# Altium schematic sheet 7_ALARM.SchDoc: Alarm and sound
size B; Author: Sebastien Gelinas; CompanyName: SmartHalo; Organization: SmartHalo; Address1: 5445 de Gaspé; Address2: Montréal, QC; Address3: Canada; Address4: H2T 3B2; Revision: 1; SheetNumber: 7; SheetTotal: 8
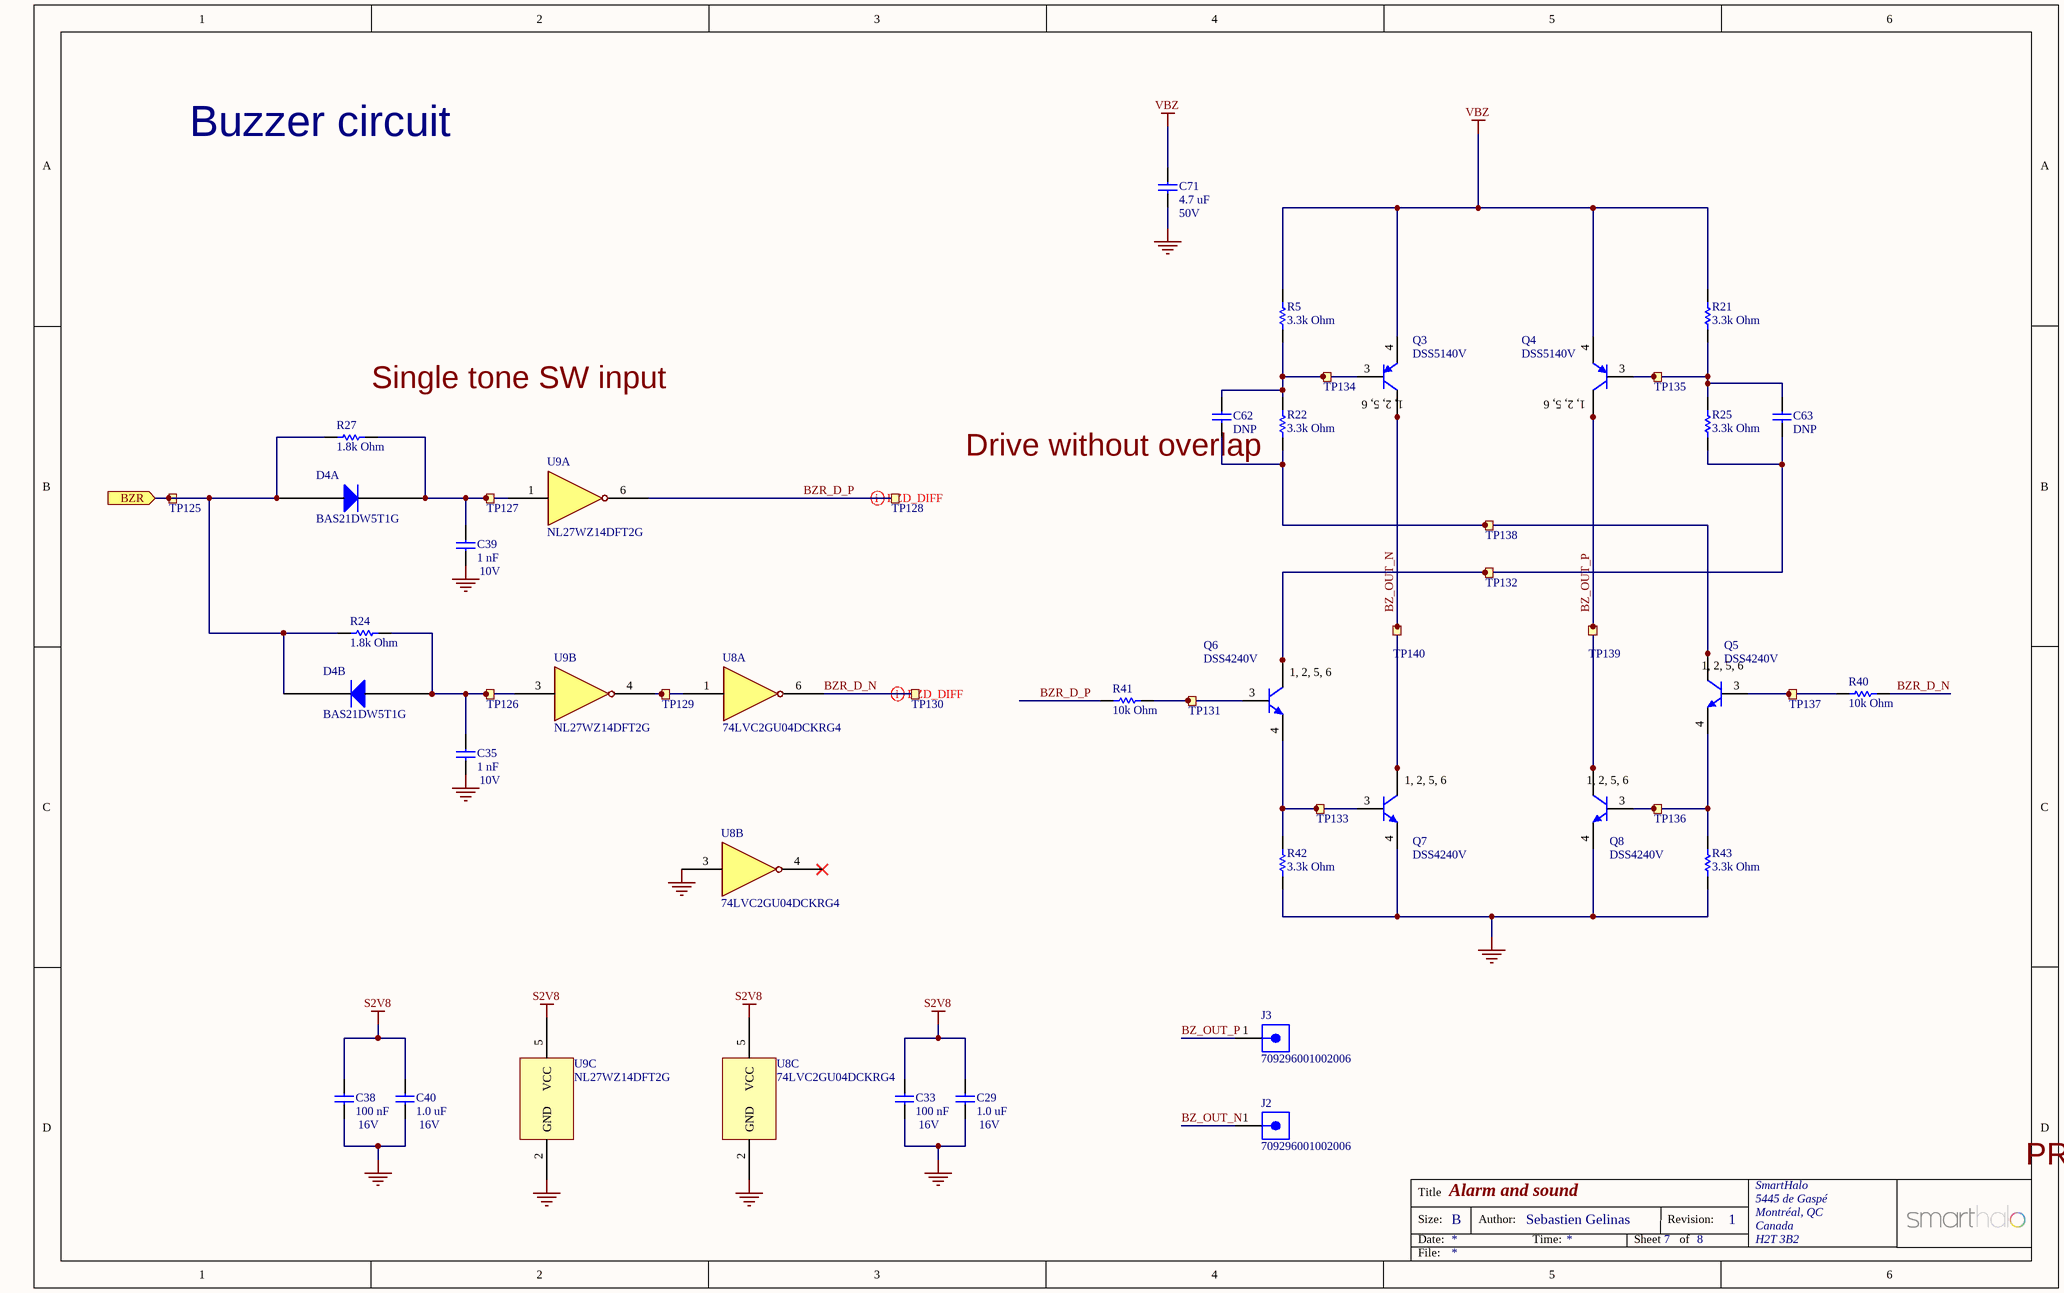
[diagram p0: 7_ALARM.SchDoc]

## Parts
C29  1.0 uF  Voltage Rating: 16V  [Varitron_CAP0603]
C33  100 nF  Voltage Rating: 16V  [Varitron_CAP0402]
C35  1 nF  Voltage Rating: 10V  [Varitron_CAP0402]
C38  100 nF  Voltage Rating: 16V  [Varitron_CAP0402]
C39  1 nF  Voltage Rating: 10V  [Varitron_CAP0402]
C40  1.0 uF  Voltage Rating: 16V  [Varitron_CAP0603]
C62  DNP  [Varitron_CAP0402]  (no BOM)
C63  DNP  [Varitron_CAP0402]  (no BOM)
C71  4.7 uF  Voltage Rating: 50V  [Varitron_CAP0805]
D4  BAS21DW5T1G  [SC70-5]  (parts A,B of 2)
J2  709296001002006  [709296001002006]
J3  709296001002006  [709296001002006]
Q3  DSS5140V  [SOT563]
Q4  DSS5140V  [SOT563]
Q5  DSS4240V  [SOT563]
Q6  DSS4240V  [SOT563]
Q7  DSS4240V  [SOT563]
Q8  DSS4240V  [SOT563]
R5  3.3k Ohm  [Varitron_RES0402]
R21  3.3k Ohm  [Varitron_RES0402]
R22  3.3k Ohm  [Varitron_RES0402]
R24  1.8k Ohm  [Varitron_RES0402]
R25  3.3k Ohm  [Varitron_RES0402]
R27  1.8k Ohm  [Varitron_RES0402]
R40  10k Ohm  [Varitron_RES0402]
R41  10k Ohm  [Varitron_RES0402]
R42  3.3k Ohm  [Varitron_RES0402]
R43  3.3k Ohm  [Varitron_RES0402]
TP125  TP125  [TESTPAD-TH-1_5mm]  (value not drawn)  (no BOM)
TP126  TP126  [TESTPAD-TH-35mils]  (value not drawn)  (no BOM)
TP127  TP127  [TESTPAD-TH-35mils]  (value not drawn)  (no BOM)
TP128  TP128  [TESTPAD-TH-35mils]  (value not drawn)  (no BOM)
TP129  TP129  [TESTPAD-TH-35mils]  (value not drawn)  (no BOM)
TP130  TP130  [TESTPAD-TH-35mils]  (value not drawn)  (no BOM)
TP131  TP131  [TESTPAD-TH-35mils]  (value not drawn)  (no BOM)
TP132  TP132  [TESTPAD-TH-35mils]  (value not drawn)  (no BOM)
TP133  TP133  [TESTPAD-TH-35mils]  (value not drawn)  (no BOM)
TP134  TP134  [TESTPAD-TH-35mils]  (value not drawn)  (no BOM)
TP135  TP135  [TESTPAD-TH-35mils]  (value not drawn)  (no BOM)
TP136  TP136  [TESTPAD-TH-35mils]  (value not drawn)  (no BOM)
TP137  TP137  [TESTPAD-TH-35mils]  (value not drawn)  (no BOM)
TP138  TP138  [TESTPAD-TH-35mils]  (value not drawn)  (no BOM)
TP139  TP139  [TESTPAD-TH-1_5mm]  (value not drawn)  (no BOM)
TP140  TP140  [TESTPAD-TH-1_5mm]  (value not drawn)  (no BOM)
U8  74LVC2GU04DCKRG4  [SOT363_SC70_6]  (parts A,B,C of 3)
U9  NL27WZ14DFT2G  [SOT363_SC70_6]  (parts A,B,C of 3)

## Ports
BZR (in)

## Nets
GND: C29.2 C33.2 C35.2 C38.2 C39.2 C40.2 C71.2 Q7.4(E) Q8.4(E) R42.2 R43.1 U8.2(GND) U8.3 U9.2(GND)
S2V8: C29.1 C33.1 C38.1 C40.1 U8.5(VCC) U9.5(VCC)
VBZ: C71.1 Q3.4(E) Q4.4(E) R5.2 R21.2
BZ_OUT_N: J2.1 Q3.1(C) Q3.2(C) Q3.5(C) Q3.6(C) Q7.1(C) Q7.2(C) Q7.5(C) Q7.6(C) TP140.1
BZ_OUT_P: J3.1 Q4.1(C) Q4.2(C) Q4.5(C) Q4.6(C) Q8.1(C) Q8.2(C) Q8.5(C) Q8.6(C) TP139.1
BZR: D4.1(Anode) D4.4(Cathode) R24.2 R27.2 TP125.1 ; port BZR
BZR_D_N: R40.2 TP130.1 U8.6
BZR_D_P: R41.2 TP128.1 U9.6
NetC35_1: C35.1 D4.3(Anode) R24.1 TP126.1 U9.3
NetC39_1: C39.1 D4.5(Cathode) R27.1 TP127.1 U9.1
NetC62_1: C62.1 Q5.1(C) Q5.2(C) Q5.5(C) Q5.6(C) R22.1 TP138.1
NetC62_2: C62.2 Q3.3(B) R5.1 R22.2 TP134.1
NetC63_1: C63.1 Q6.1(C) Q6.2(C) Q6.5(C) Q6.6(C) R25.1 TP132.1
NetC63_2: C63.2 Q4.3(B) R21.1 R25.2 TP135.1
NetQ5_3: Q5.3(B) R40.1 TP137.1
NetQ5_4: Q5.4(E) Q8.3(B) R43.2 TP136.1
NetQ6_3: Q6.3(B) R41.1 TP131.1
NetQ6_4: Q6.4(E) Q7.3(B) R42.1 TP133.1
NetTP129_1: TP129.1 U8.1 U9.4

Not connected (* = marked no-connect by the designer): D4 2; U8 4*

## Layout directives
differential pair: BZR_D_N, BZR_D_P

## Notes on the sheet
- Buzzer circuit
- (near R27) Single tone SW input
- Drive without overlap
- PRELIMINARY: DO NOT USE FOR PRODUCTION
- Title
- Size:
- Date:
- B
- Author:
- Time:
- Sheet
- Revision:
- of
- File:
- (in symbol DSS4240V) 1, 2, 5, 6
- (in symbol DSS5140V) 1, 2, 5, 6

## Library data of the parts
C29 C40 = Varitron_CAP0603: 1.0 uF 16V X7R 10% 0603 (1608 Metric)  SMD; Manufacturer: Samsung; Manufacturer Part Number: CL10B105KO8NNNC; SmartHalo Part Number: 630002-01; Case-EIA: 0603; Case-Metric: 1608; Final: N; Tolerance: 10%; Technology: SMT; Temperature Coefficient: X7R; Part Number: CL10B105KO8NNNC; Value: 1.0 uF; Supplier: Arrow Electronics; Footprint Name: 0603
C33 C38 = Varitron_CAP0402: 100 nF 16V X7R 10% 0402 (1005 Metric)  SMD; Manufacturer: Samsung; Manufacturer Part Number: CL05B104KO5NNNC; SmartHalo Part Number: 630003-01; Case-EIA: 0402; Case-Metric: 1005; Final: N; Tolerance: 10%; Technology: SMT; Temperature Coefficient: X7R; Part Number: CL05B104KO5NNNC; Value: 100 nF; Supplier: Arrow Electronics; Footprint Name: 0402
C35 C39 = Varitron_CAP0402: 1 nF 10V X7R 10% 0402 (1005 Metric)  SMD; Manufacturer: AVX; Manufacturer Part Number: 0402ZC102KAT2A; SmartHalo Part Number: 630012-01; Case-EIA: 0402; Case-Metric: 1005; Final: N; Tolerance: 10%; Technology: SMT; Temperature Coefficient: X7R; Part Number: 0402ZC102KAT2A; Value: 1 nF; Supplier: Arrow Electronics; Footprint Name: 0402
C62 C63 = Varitron_CAP0402: 220 pF 50V X7R 10% 0402 (1005 Metric)  SMD; Case-EIA: 0402; Case-Metric: 1005; Final: N; Value: 220 pF; Tolerance: 10%; Technology: SMT; Temperature Coefficient: X7R; Supplier: Arrow Electronics; Footprint Name: 0402; Voltage Rating: 50V
C71 = Varitron_CAP0805: 4.7 uF 50V X5R 10% 0805 (2012 Metric)  SMD; Manufacturer: Samsung; Manufacturer Part Number: CL21A475KBQNNNE; SmartHalo Part Number: 630010-01; Case-EIA: 0805; Case-Metric: 2012; Final: N; Tolerance: 10%; Technology: SMT; Temperature Coefficient: X5R; Part Number: CL21A475KBQNNNE; Supplier: Arrow Electronics; Footprint Name: 0805; Value: 4.7 uF
D4 = BAS21DW5T1G: High Voltage Switching Diode; Manufacturer: ON Semiconductor; SmartHalo Part Number: 630018-01; Final: Y; Manufacturer Part Number: BAS21DW5T1G; Part Number: BAS21DW5T1G; Footprint Name: SC70-5; Supplier: Arrow Electronics
J2 J3 = 709296001002006: Connector, Single Horizontal Contact, 2 x 2 mm; Manufacturer: AVX; SmartHalo Part Number: 630020-01; Final: Y; Manufacturer Part Number: 709296001002006; Part Number: 709296001002006; Footprint Name: CUSTOM(Wire to board connector); Supplier: Arrow Electronics; Supplier Part Number: *
Q3 Q4 = DSS5140V: PNP SMT Transistor, Low VCESAT; Manufacturer: Diodes Inc.; SmartHalo Part Number: 630031-01; Final: N; hfe: 300; VBE: -1V; VCESAT: -310 mV; Supplier: Arrow Electronics; Part Number: DSS5140V; Manufacturer Part Number: DSS5140V; Footprint Name: SOT563
Q5-Q8 = DSS4240V: NPN SMT Transistor, Low VCESAT; Manufacturer: Diodes Inc.; SmartHalo Part Number: 630032-01; Final: N; hfe: 300; VBE: 1.1V; VCESAT: 400 mV; Supplier: Arrow Electronics; Part Number: DSS4240V; Manufacturer Part Number: DSS4240V; Footprint Name: SOT563
R5 = Varitron_RES0402: 3k3 0.063W 5%  0402 (1005 Metric)  SMD; Manufacturer: Samsung; Manufacturer Part Number: RC1005J332CS; SmartHalo Part Number: 630037-01; Case-Metric: 1005; Power: 0.063; Case-EIA: 0402; Final: N; Tolerance: 5%; Technology: SMT; Part Number: RC1005J332CS; Supplier: Arrow Electronics; Footprint Name: 0402; Value: 3.3k Ohm
R21 R22 R25 R42 R43 = Varitron_RES0402: 3k3 0.063W 5%  0402 (1005 Metric)  SMD; Manufacturer: Samsung; Manufacturer Part Number: RC1005J332CS; SmartHalo Part Number: 630037-01; Case-Metric: 1005; Case-EIA: 0402; Final: N; Tolerance: 5%; Technology: SMT; Power: 0.063W; Part Number: RC1005J332CS; Supplier: Arrow Electronics; Footprint Name: 0402; Value: 3.3k Ohm
R24 R27 = Varitron_RES0402: 1k8 0.063W 5%  0402 (1005 Metric)  SMD; Manufacturer: Samsung; Manufacturer Part Number: RC1005J182CS; SmartHalo Part Number: 630046-01; Case-Metric: 1005; Case-EIA: 0402; Final: N; Tolerance: 5%; Technology: SMT; Power: 0.063W; Part Number: RC1005J182CS; Value: 1.8k Ohm; Footprint Name: 0402; Supplier: Arrow Electronics
R40 R41 = Varitron_RES0402: 10k 0.063W 5%  0402 (1005 Metric)  SMD; Manufacturer: Samsung; Manufacturer Part Number: RC1005J103CS; SmartHalo Part Number: 630041-01; Case-Metric: 1005; Case-EIA: 0402; Final: N; Tolerance: 5%; Technology: SMT; Power: 0.063W; Part Number: RC1005J103CS; Supplier: Arrow Electronics; Footprint Name: 0402; Value: 10k Ohm
TP125 TP139 TP140 = TESTPAD_TH_1_5MM: Testpoint, through hole, 1.5mm; Value: TP
TP126-TP138 = TESTPAD_TH_35mils: Testpoint, through hole, 35 mils; Value: TP
U8 = 74LVC2GU04DCKRG4: Dual Inverter Gate; Manufacturer: Texas Instruments; SmartHalo Part Number: 630057-01; Final: Y; Manufacturer Part Number: 74LVC2GU04DCKRG4; Part Number: 74LVC2GU04DCKRG4; Supplier: Arrow Electronics; Footprint Name: SOT363
U9 = NL27WZ14DFT2G: IC Dual Inverter with Schmitt Trigger Inputs; Manufacturer: ON Semiconductor; SmartHalo Part Number: 630058-01; Final: Y; Manufacturer Part Number: NL27WZ14DFT2G; Part Number: NL27WZ14DFT2G; Footprint Name: SOT363; Supplier: Arrow Electronics